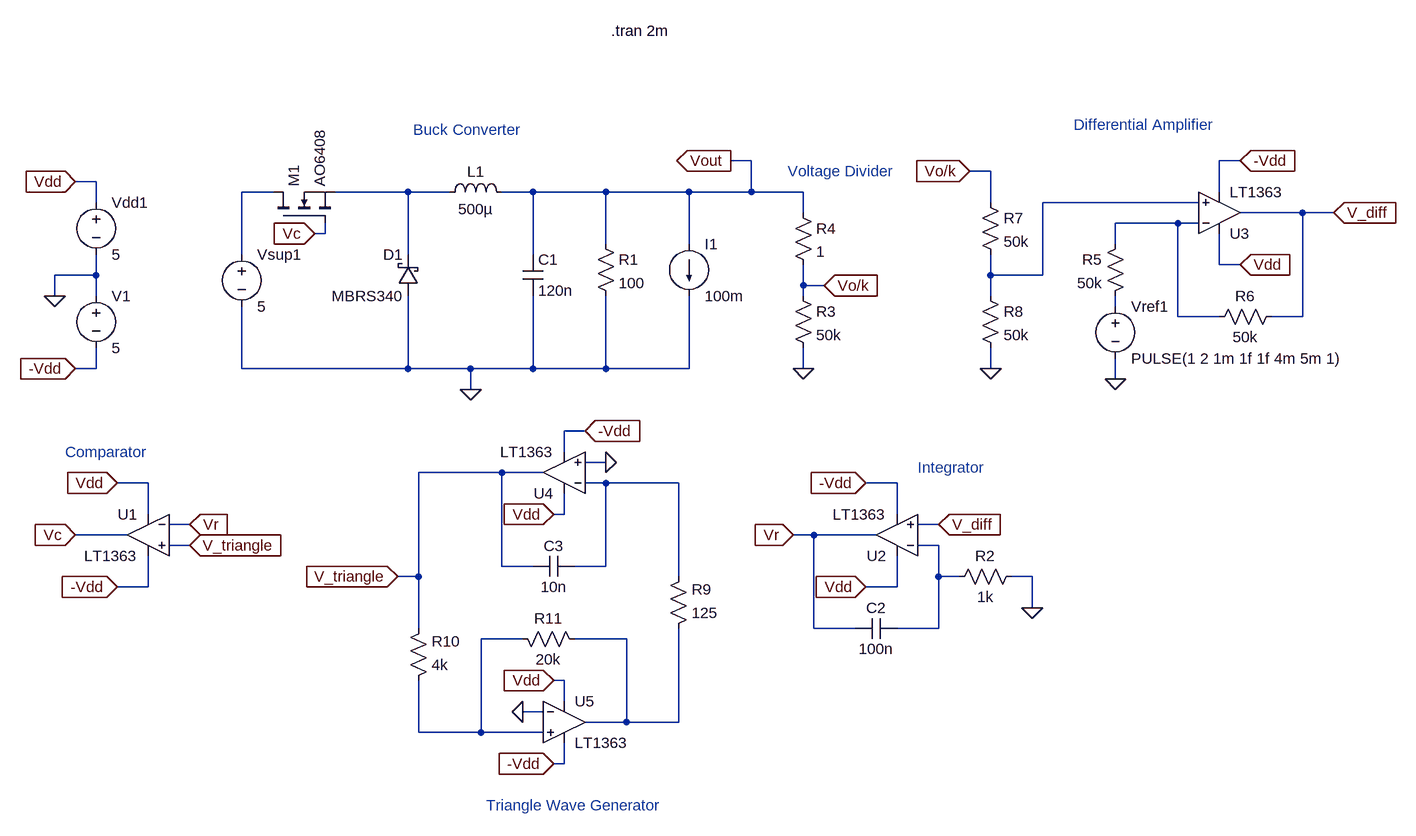
[diagram p0: schematic Q2.asc]
Q2.asc, the LTspice schematic file:
Version 4
SHEET 1 1524 1056
WIRE 512 48 480 48
WIRE 1264 48 1232 48
WIRE 880 64 848 64
WIRE -496 80 -528 80
WIRE -224 96 -272 96
WIRE -16 96 -128 96
WIRE 48 96 -16 96
WIRE 176 96 128 96
WIRE 288 96 176 96
WIRE 416 96 288 96
WIRE 512 96 512 48
WIRE 512 96 416 96
WIRE 592 96 512 96
WIRE 1232 96 1232 48
WIRE -496 112 -496 80
WIRE 880 112 880 64
WIRE 1200 112 960 112
WIRE 592 128 592 96
WIRE 1360 128 1264 128
WIRE 1408 128 1360 128
WIRE 1168 144 1072 144
WIRE 1200 144 1168 144
WIRE -144 160 -144 144
WIRE -144 160 -160 160
WIRE 288 176 288 96
WIRE 416 176 416 96
WIRE 1072 176 1072 144
WIRE -272 192 -272 96
WIRE -16 192 -16 96
WIRE 176 192 176 96
WIRE 1232 208 1232 160
WIRE 1264 208 1232 208
WIRE -496 224 -496 192
WIRE -496 224 -560 224
WIRE 880 224 880 192
WIRE 960 224 960 112
WIRE 960 224 880 224
WIRE 592 240 592 208
WIRE 624 240 592 240
WIRE -560 256 -560 224
WIRE -496 256 -496 224
WIRE 592 256 592 240
WIRE 880 256 880 224
WIRE 1072 272 1072 256
WIRE 1168 288 1168 144
WIRE 1232 288 1168 288
WIRE 1360 288 1360 128
WIRE 1360 288 1312 288
WIRE -496 368 -496 336
WIRE -496 368 -528 368
WIRE -272 368 -272 272
WIRE -16 368 -16 256
WIRE -16 368 -272 368
WIRE 80 368 -16 368
WIRE 176 368 176 256
WIRE 176 368 80 368
WIRE 288 368 288 256
WIRE 288 368 176 368
WIRE 416 368 416 256
WIRE 416 368 288 368
WIRE 592 368 592 336
WIRE 880 368 880 336
WIRE 1072 384 1072 352
WIRE 80 400 80 368
WIRE 256 464 224 464
WIRE 224 496 224 464
WIRE 288 512 256 512
WIRE 128 528 0 528
WIRE 192 528 128 528
WIRE -416 544 -464 544
WIRE 288 544 256 544
WIRE 400 544 288 544
WIRE 736 544 688 544
WIRE -416 592 -416 544
WIRE 224 592 224 560
WIRE 224 592 208 592
WIRE 736 592 736 544
WIRE -352 608 -384 608
WIRE 800 608 768 608
WIRE -448 624 -528 624
WIRE 608 624 576 624
WIRE 704 624 608 624
WIRE -352 640 -384 640
WIRE 800 640 768 640
WIRE 128 672 128 528
WIRE 176 672 128 672
WIRE 288 672 288 544
WIRE 288 672 240 672
WIRE 0 688 0 528
WIRE 0 688 -32 688
WIRE 400 688 400 544
WIRE 800 688 800 640
WIRE 832 688 800 688
WIRE 944 688 912 688
WIRE -416 704 -416 656
WIRE -416 704 -464 704
WIRE 736 704 736 656
WIRE 736 704 688 704
WIRE 944 736 944 688
WIRE 0 768 0 688
WIRE 608 768 608 624
WIRE 672 768 608 768
WIRE 800 768 800 688
WIRE 800 768 736 768
WIRE 160 784 96 784
WIRE 320 784 240 784
WIRE 224 848 208 848
WIRE 224 880 224 848
WIRE 192 896 160 896
WIRE 320 912 320 784
WIRE 320 912 256 912
WIRE 400 912 400 768
WIRE 400 912 320 912
WIRE 0 928 0 848
WIRE 96 928 96 784
WIRE 96 928 0 928
WIRE 192 928 96 928
WIRE 224 976 224 944
WIRE 224 976 208 976
FLAG 80 400 0
FLAG 480 48 Vout
IOPIN 480 48 Out
FLAG -160 160 Vc
IOPIN -160 160 In
FLAG -528 368 -Vdd
IOPIN -528 368 In
FLAG -528 80 Vdd
IOPIN -528 80 In
FLAG -560 256 0
FLAG -528 624 Vc
IOPIN -528 624 In
FLAG -464 704 -Vdd
IOPIN -464 704 In
FLAG -464 544 Vdd
IOPIN -464 544 In
FLAG -352 608 Vr
IOPIN -352 608 In
FLAG 688 544 -Vdd
IOPIN 688 544 In
FLAG 688 704 Vdd
IOPIN 688 704 In
FLAG 576 624 Vr
IOPIN 576 624 In
FLAG 592 368 0
FLAG 1072 384 0
FLAG 1264 48 -Vdd
IOPIN 1264 48 In
FLAG 1264 208 Vdd
IOPIN 1264 208 In
FLAG 944 736 0
FLAG 624 240 Vo/k
IOPIN 624 240 In
FLAG 1408 128 V_diff
IOPIN 1408 128 In
FLAG 800 608 V_diff
IOPIN 800 608 In
FLAG 880 368 0
FLAG 848 64 Vo/k
IOPIN 848 64 In
FLAG -352 640 V_triangle
IOPIN -352 640 In
FLAG 208 592 Vdd
IOPIN 208 592 In
FLAG 256 464 -Vdd
IOPIN 256 464 In
FLAG 208 848 Vdd
IOPIN 208 848 In
FLAG 208 976 -Vdd
IOPIN 208 976 In
FLAG 288 512 0
FLAG 160 896 0
FLAG -32 688 V_triangle
IOPIN -32 688 In
SYMBOL ind 32 112 R270
WINDOW 0 32 56 VTop 2
WINDOW 3 5 56 VBottom 2
SYMATTR InstName L1
SYMATTR Value 500µ
SYMBOL cap 160 192 R0
SYMATTR InstName C1
SYMATTR Value 120n
SYMBOL res 272 160 R0
SYMATTR InstName R1
SYMATTR Value 100
SYMBOL current 416 176 R0
SYMATTR InstName I1
SYMATTR Value 100m
SYMBOL voltage -272 176 R0
SYMATTR InstName Vsup1
SYMATTR Value 5
SYMBOL nmos -224 144 R270
SYMATTR InstName M1
SYMATTR Value AO6408
SYMBOL schottky 0 256 R180
WINDOW 0 24 64 Left 2
WINDOW 3 24 0 Left 2
SYMATTR InstName D1
SYMATTR Value MBRS340
SYMATTR Description Diode
SYMATTR Type diode
SYMBOL voltage -496 96 R0
SYMATTR InstName Vdd1
SYMATTR Value 5
SYMBOL voltage -496 240 R0
SYMATTR InstName V1
SYMATTR Value 5
SYMBOL opamps/LT1363 -416 560 M0
SYMATTR InstName U1
SYMBOL opamps/LT1363 736 688 R180
SYMATTR InstName U2
SYMBOL cap 736 784 M270
WINDOW 0 32 32 VTop 2
WINDOW 3 0 32 VBottom 2
SYMATTR InstName C2
SYMATTR Value 100n
SYMBOL res 816 704 R270
WINDOW 0 32 56 VTop 2
WINDOW 3 0 56 VBottom 2
SYMATTR InstName R2
SYMATTR Value 1k
SYMBOL res 576 240 R0
SYMATTR InstName R3
SYMATTR Value 50k
SYMBOL res 576 112 R0
SYMATTR InstName R4
SYMATTR Value 1
SYMBOL opamps/LT1363 1232 192 M180
SYMATTR InstName U3
SYMBOL voltage 1072 256 R0
SYMATTR InstName Vref1
SYMATTR Value PULSE(1 2 1m 1f 1f 4m 5m 1)
SYMBOL res 1088 160 M0
SYMATTR InstName R5
SYMATTR Value 50k
SYMBOL res 1328 272 R90
WINDOW 0 0 56 VBottom 2
WINDOW 3 32 56 VTop 2
SYMATTR InstName R6
SYMATTR Value 50k
SYMBOL res 864 96 R0
SYMATTR InstName R7
SYMATTR Value 50k
SYMBOL res 864 240 R0
SYMATTR InstName R8
SYMATTR Value 50k
SYMBOL res 384 784 M180
WINDOW 0 36 76 Left 2
WINDOW 3 36 40 Left 2
SYMATTR InstName R9
SYMATTR Value 125
SYMBOL res -16 864 M180
WINDOW 0 36 76 Left 2
WINDOW 3 36 40 Left 2
SYMATTR InstName R10
SYMATTR Value 4k
SYMBOL res 144 768 M90
WINDOW 0 0 56 VBottom 2
WINDOW 3 32 56 VTop 2
SYMATTR InstName R11
SYMATTR Value 20k
SYMBOL cap 176 656 M90
WINDOW 0 0 32 VBottom 2
WINDOW 3 32 32 VTop 2
SYMATTR InstName C3
SYMATTR Value 10n
SYMBOL opamps/LT1363 224 592 R180
SYMATTR InstName U4
SYMBOL opamps/LT1363 224 848 R0
SYMATTR InstName U5
TEXT 296 -152 Left 2 !.tran 2m
TEXT -8 0 Left 2 ;Buck Converter
TEXT 568 64 Left 2 ;Voltage Divider
TEXT 1008 -8 Left 2 ;Differential Amplifier
TEXT 768 520 Left 2 ;Integrator
TEXT -544 496 Left 2 ;Comparator
TEXT 104 1040 Left 2 ;Triangle Wave Generator

The netlist it stands for:
* Q2.asc
L1 N002 Vout 500µ
C1 Vout 0 120n
R1 Vout 0 100
I1 Vout 0 100m
Vsup1 N001 0 5
M1 N001 Vc N002 N002 AO6408
D1 0 N002 MBRS340
Vdd1 Vdd 0 5
V1 0 -Vdd 5
XU1 V_triangle Vr Vdd -Vdd Vc LT1363  ; pins In+ In- V+ V- OUT
XU2 V_diff N007 Vdd -Vdd Vr LT1363  ; pins In+ In- V+ V- OUT
C2 N007 Vr 100n
R2 N007 0 1k
R3 Vo/k 0 50k
R4 Vout Vo/k 1
XU3 N003 N004 Vdd -Vdd V_diff LT1363  ; pins In+ In- V+ V- OUT
Vref1 N005 0 PULSE(1 2 1m 1f 1f 4m 5m 1)
R5 N004 N005 50k
R6 V_diff N004 50k
R7 Vo/k N003 50k
R8 N003 0 50k
R9 N009 N006 125
R10 N008 V_triangle 4k
R11 N008 N009 20k
C3 V_triangle N006 10n
XU4 0 N006 Vdd -Vdd V_triangle LT1363  ; pins In+ In- V+ V- OUT
XU5 N008 0 Vdd -Vdd N009 LT1363  ; pins In+ In- V+ V- OUT
.model D D
.lib standard.dio
.model NMOS NMOS
.model PMOS PMOS
.lib standard.mos
.tran 2m
* Buck Converter
* Voltage Divider
* Differential Amplifier
* Integrator
* Comparator
* Triangle Wave Generator
.lib LT1363.sub
.backanno
.end